# EAGLE schematic DigitalStylophone (EAGLE 9.6.2)
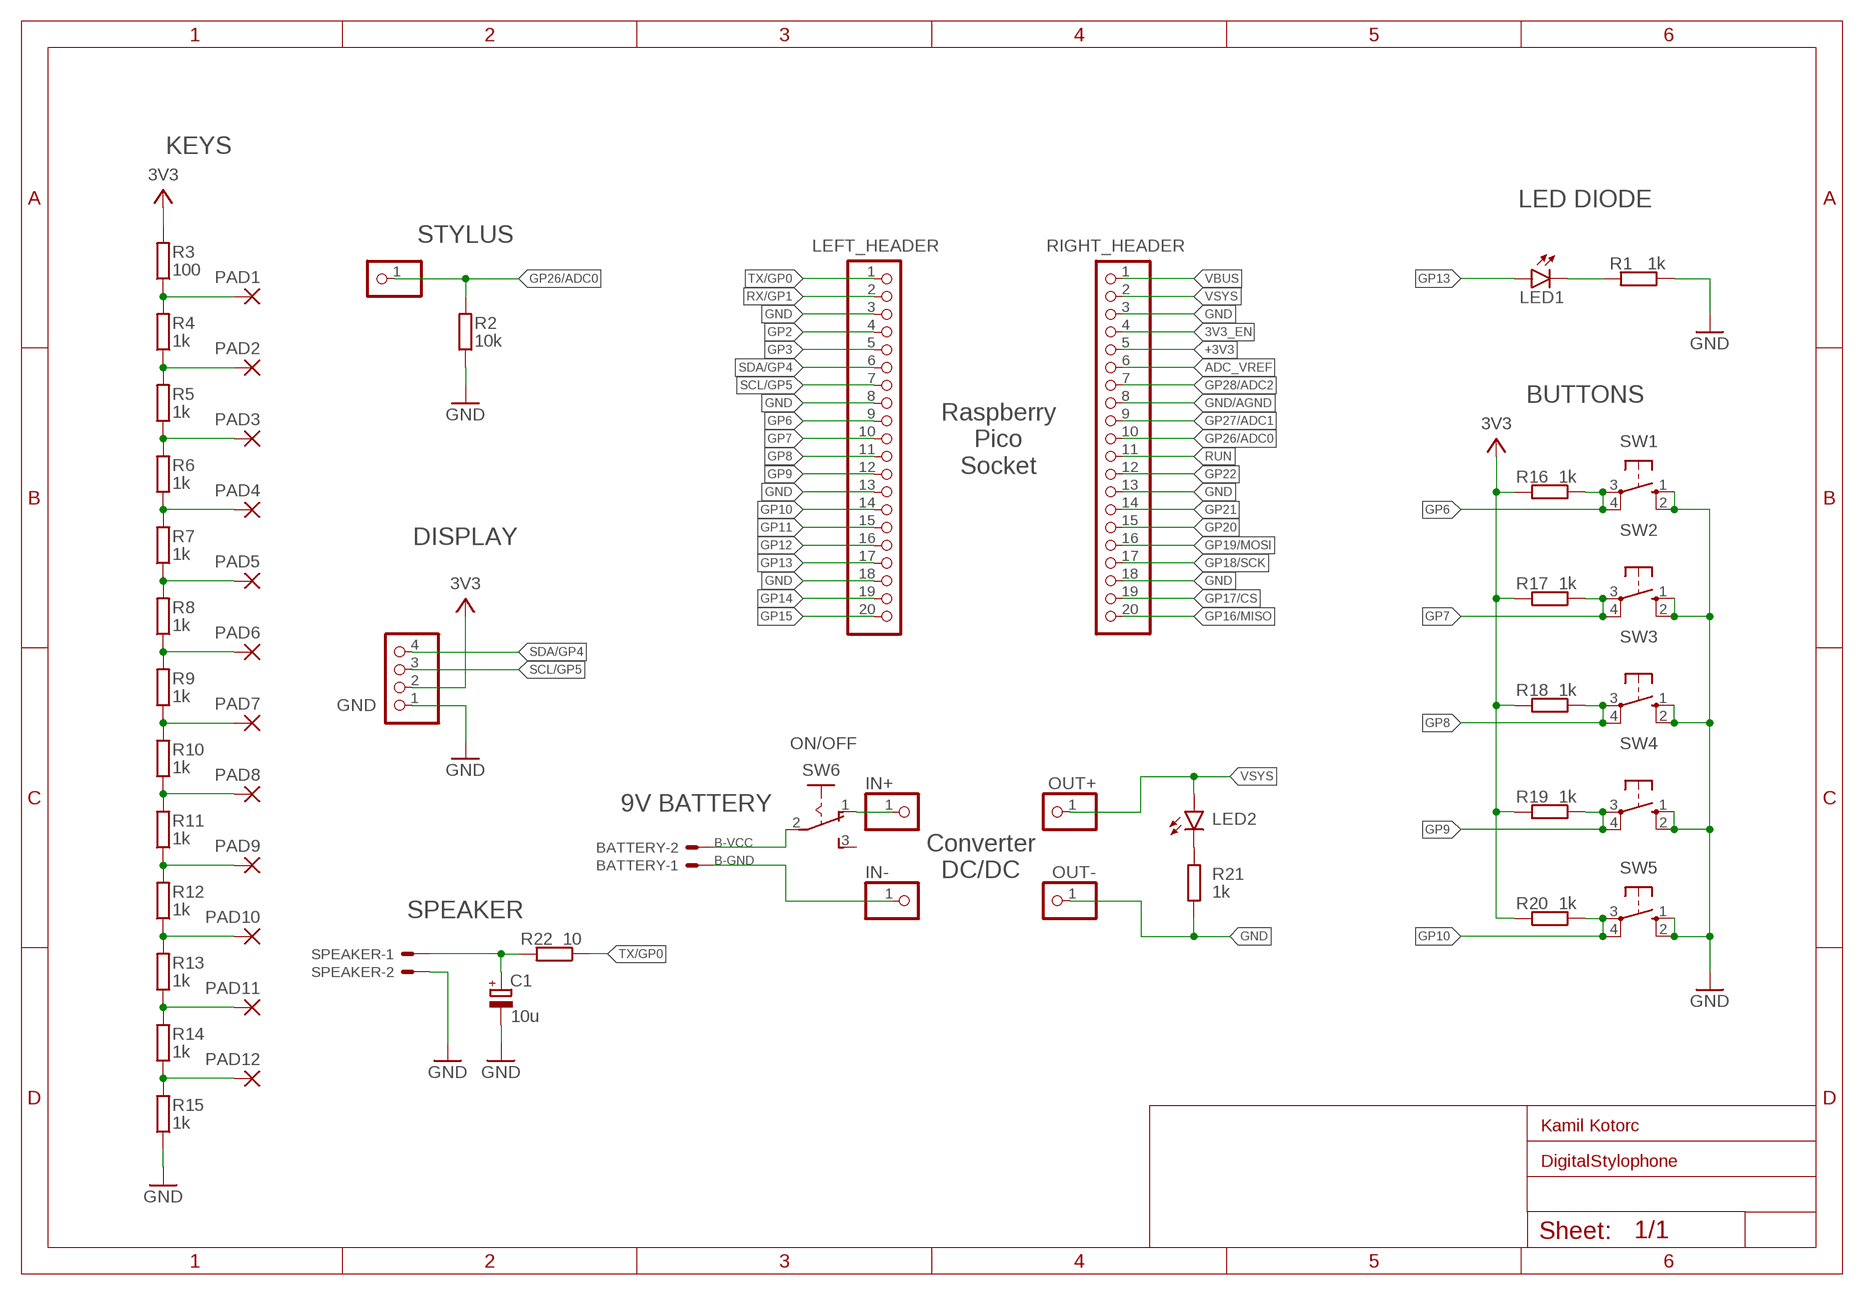
[diagram p0: schematic, sheet 1]
FRAME1 (A4L-LOC): AUTHOR: Kamil Kotorc; PROJECT: Stylofon z możliwością nagrywania utworów

## Parts
BATTERY  9V BATTERY  22-23-2021  [22-23-2021]
C1  10u  CPOL-EUE2.5-5  [E2,5-5]
DISPLAY  GND  PINHD-1X4  [1X04]
IN+  PINHD-1X1  [1X01]
IN-  PINHD-1X1  [1X01]
LED1  LED5MM  [LED5MM]
LED2  LED3MM  [LED3MM]
LEFT_HEADER  PINHD-1X20  [1X20]
OUT+  PINHD-1X1  [1X01]
OUT-  PINHD-1X1  [1X01]
PAD1  SMD5  [SMD2,54-5,08]
PAD2  SMD5  [SMD2,54-5,08]
PAD3  SMD5  [SMD2,54-5,08]
PAD4  SMD5  [SMD2,54-5,08]
PAD5  SMD5  [SMD2,54-5,08]
PAD6  SMD5  [SMD2,54-5,08]
PAD7  SMD5  [SMD2,54-5,08]
PAD8  SMD5  [SMD2,54-5,08]
PAD9  SMD5  [SMD2,54-5,08]
PAD10  SMD5  [SMD2,54-5,08]
PAD11  SMD5  [SMD2,54-5,08]
PAD12  SMD5  [SMD2,54-5,08]
R1  1k  R-EU_0204/7  [0204/7]
R2  10k  R-EU_0204/7  [0204/7]
R3  100  R-EU_0204/7  [0204/7]
R4  1k  R-EU_0204/7  [0204/7]
R5  1k  R-EU_0204/7  [0204/7]
R6  1k  R-EU_0204/7  [0204/7]
R7  1k  R-EU_0204/7  [0204/7]
R8  1k  R-EU_0204/7  [0204/7]
R9  1k  R-EU_0204/7  [0204/7]
R10  1k  R-EU_0204/7  [0204/7]
R11  1k  R-EU_0204/7  [0204/7]
R12  1k  R-EU_0204/7  [0204/7]
R13  1k  R-EU_0204/7  [0204/7]
R14  1k  R-EU_0204/7  [0204/7]
R15  1k  R-EU_0204/7  [0204/7]
R16  1k  R-EU_0204/7  [0204/7]
R17  1k  R-EU_0204/7  [0204/7]
R18  1k  R-EU_0204/7  [0204/7]
R19  1k  R-EU_0204/7  [0204/7]
R20  1k  R-EU_0204/7  [0204/7]
R21  1k  R-EU_0204/7  [0204/7]
R22  10  R-EU_0204/7  [0204/7]
RIGHT_HEADER  PINHD-1X20  [1X20]
SPEAKER  SPEAKER  22-23-2021  [22-23-2021]
STYLUS  PINHD-1X1  [1X01]
SW1  10-XX  [B3F-10XX]
SW2  10-XX  [B3F-10XX]
SW3  10-XX  [B3F-10XX]
SW4  10-XX  [B3F-10XX]
SW5  10-XX  [B3F-10XX]
SW6  ON/OFF  255SB  [255SB]

## Nets
3V3_EN: RIGHT_HEADER.4
+3V3: DISPLAY.2 R3.2 R16.2 R17.2 R18.2 R19.2 R20.2 RIGHT_HEADER.5 ; supply symbol labelled 3V3
ADC_VREF: RIGHT_HEADER.6
B-GND: BATTERY.1 IN-.1
B-SW: IN+.1 SW6.1(O)
B-VCC: BATTERY.2 SW6.2(P)
GND: C1.- DISPLAY.1 LEFT_HEADER.3 LEFT_HEADER.8 LEFT_HEADER.13 LEFT_HEADER.18 OUT-.1 R1.1 R2.1 R15.1 R21.1 RIGHT_HEADER.3 RIGHT_HEADER.13 RIGHT_HEADER.18 SPEAKER.2 SW1.1(S) SW1.2(S1) SW2.1(S) SW2.2(S1) SW3.1(S) SW3.2(S1) SW4.1(S) SW4.2(S1) SW5.1(S) SW5.2(S1)
GND/AGND: RIGHT_HEADER.8
GP2: LEFT_HEADER.4
GP3: LEFT_HEADER.5
GP6: LEFT_HEADER.9 R16.1 SW1.3(P) SW1.4(P1)
GP7: LEFT_HEADER.10 R17.1 SW2.3(P) SW2.4(P1)
GP8: LEFT_HEADER.11 R18.1 SW3.3(P) SW3.4(P1)
GP9: LEFT_HEADER.12 R19.1 SW4.3(P) SW4.4(P1)
GP10: LEFT_HEADER.14 R20.1 SW5.3(P) SW5.4(P1)
GP11: LEFT_HEADER.15
GP12: LEFT_HEADER.16
GP13: LED1.A LEFT_HEADER.17
GP14: LEFT_HEADER.19
GP15: LEFT_HEADER.20
GP16/MISO: RIGHT_HEADER.20
GP17/CS: RIGHT_HEADER.19
GP18/SCK: RIGHT_HEADER.17
GP19/MOSI: RIGHT_HEADER.16
GP20: RIGHT_HEADER.15
GP21: RIGHT_HEADER.14
GP22: RIGHT_HEADER.12
GP26/ADC0: R2.2 RIGHT_HEADER.10 STYLUS.1
GP27/ADC1: RIGHT_HEADER.9
GP28/ADC2: RIGHT_HEADER.7
LED: LED1.K(C) R1.2
N$1: C1.+ R22.2 SPEAKER.1
N$13: LED2.K(C) R21.2
P1: PAD1.1(P) R3.1 R4.2
P2: PAD2.1(P) R4.1 R5.2
P3: PAD3.1(P) R5.1 R6.2
P4: PAD4.1(P) R6.1 R7.2
P5: PAD5.1(P) R7.1 R8.2
P6: PAD6.1(P) R8.1 R9.2
P7: PAD7.1(P) R9.1 R10.2
P8: PAD8.1(P) R10.1 R11.2
P9: PAD9.1(P) R11.1 R12.2
P10: PAD10.1(P) R12.1 R13.2
P11: PAD11.1(P) R13.1 R14.2
P12: PAD12.1(P) R14.1 R15.2
RUN: RIGHT_HEADER.11
RX/GP1: LEFT_HEADER.2
SCL/GP5: DISPLAY.3 LEFT_HEADER.7
SDA/GP4: DISPLAY.4 LEFT_HEADER.6
TX/GP0: LEFT_HEADER.1 R22.1
VBUS: RIGHT_HEADER.1
VSYS: LED2.A OUT+.1 RIGHT_HEADER.2
Unconnected: SW6.3(S)

## Notes on the sheet
- KEYS
- LED DIODE
- BUTTONS
- Raspberry
  Pico
  Socket
- Converter
  DC/DC

## Library data of the parts
BATTERY SPEAKER = con-molex:22-23-2021: .100" (2.54mm) Center Header - 2 Pin; MF: MOLEX; MPN: 22-23-2021; OC_FARNELL: 1462926; OC_NEWARK: 25C3832
C1 = rcl:CPOL-EU: POLARIZED CAPACITOR, European symbol; SPICEPREFIX: C
DISPLAY = pinhead:PINHD-1X4: PIN HEADER
IN+ IN- OUT+ OUT- STYLUS = pinhead:PINHD-1X1: PIN HEADER
LED1 LED2 = led:LED: LED OSRAM: - CHIPLED LG R971, LG N971, LY N971, LG Q971, LY Q971, LO R971, LY R971 LH N974, LH R974 LS Q976, LO Q976, LY Q976 LO Q996 - Hyper CHIPLED LW Q18S LB Q993, LB Q99A, LB R99A - SideLED LS A670, LO A670, LY A670, LG A670, LP A670 LB A673, LV A673, LT A673, LW A673 LH A674 LY A675 LS A676, LA A676, LO A676, LY A676, LW A676 LS A679, LY A679, LG A679 - Hyper Micro SIDELED® LS Y876, LA Y876, LO Y876, LY Y876 LT Y87S - SmartLED LW L88C, LW L88S LB L89C, LB L89S, LG L890 LS L89K, LO L89K, LY L89K LS L896, LA L896, LO L896, LY L896 - TOPLED LS T670, LO T670, LY T670, LG T670, LP T670 LSG T670, LSP T670, LSY T670, LOP T670, LYG T670 LG T671, LOG T671, LSG T671 LB T673, LV T673, LT T673, LW T673 LH T674 LS T676, LA T676, LO T676, LY T676, LB T676, LH T676, LSB T676, LW T676 LB T67C, LV T67C, LT T67C, LS T67K, LO T67K, LY T67K, LW E67C LS E67B, LA E67B, LO E67B, LY E67B, LB E67C, LV E67C, LT E67C LW T67C LS T679, LY T679, LG T679 LS T770, LO T770, LY T770, LG T770, LP T770 LB T773, LV T773, LT T773, LW T773 LH T774 LS E675, LA E675, LY E675, LS T675 LS T776, LA T776, LO T776, LY T776, LB T776 LHGB T686 LT T68C, LB T68C - Hyper Mini TOPLED® LB M676 - Mini TOPLED Santana® LG M470 LS M47K, LO M47K, LY M47K Source: http://www.osram.convergy.de LUXEON: - LUMILED® LXK2-PW12-R00, LXK2-PW12-S00, LXK2-PW14-U00, LXK2-PW14-V00 LXK2-PM12-R00, LXK2-PM12-S00, LXK2-PM14-U00 LXK2-PE12-Q00, LXK2-PE12-R00, LXK2-PE12-S00, LXK2-PE14-T00, LXK2-PE14-U00 LXK2-PB12-K00, LXK2-PB12-L00, LXK2-PB12-M00, LXK2-PB14-N00, LXK2-PB14-P00, LXK2-PB14-Q00 LXK2-PR12-L00, LXK2-PR12-M00, LXK2-PR14-Q00, LXK2-PR14-R00 LXK2-PD12-Q00, LXK2-PD12-R00, LXK2-PD12-S00 LXK2-PH12-R00, LXK2-PH12-S00 LXK2-PL12-P00, LXK2-PL12-Q00, LXK2-PL12-R00 Source: www.luxeon.com KINGBRIGHT: KA-3528ASYC Source: www.kingbright.com
LEFT_HEADER RIGHT_HEADER = pinhead:PINHD-1X20: PIN HEADER
PAD1-PAD12 = wirepad:SMD5: SMD PAD
R1-R22 = rcl:R-EU_: RESISTOR, European symbol; SPICEPREFIX: R
SW1-SW5 = switch-omron:10-XX: OMRON SWITCH; MPN: B3F-1000; OC_FARNELL: 176432; OC_NEWARK: 36M3542
SW6 = switch:255SB: SLIDING SWITCH Distributor Buerklin, 11G810